# Altium schematic sheet Sheet1.SchDoc
size A2
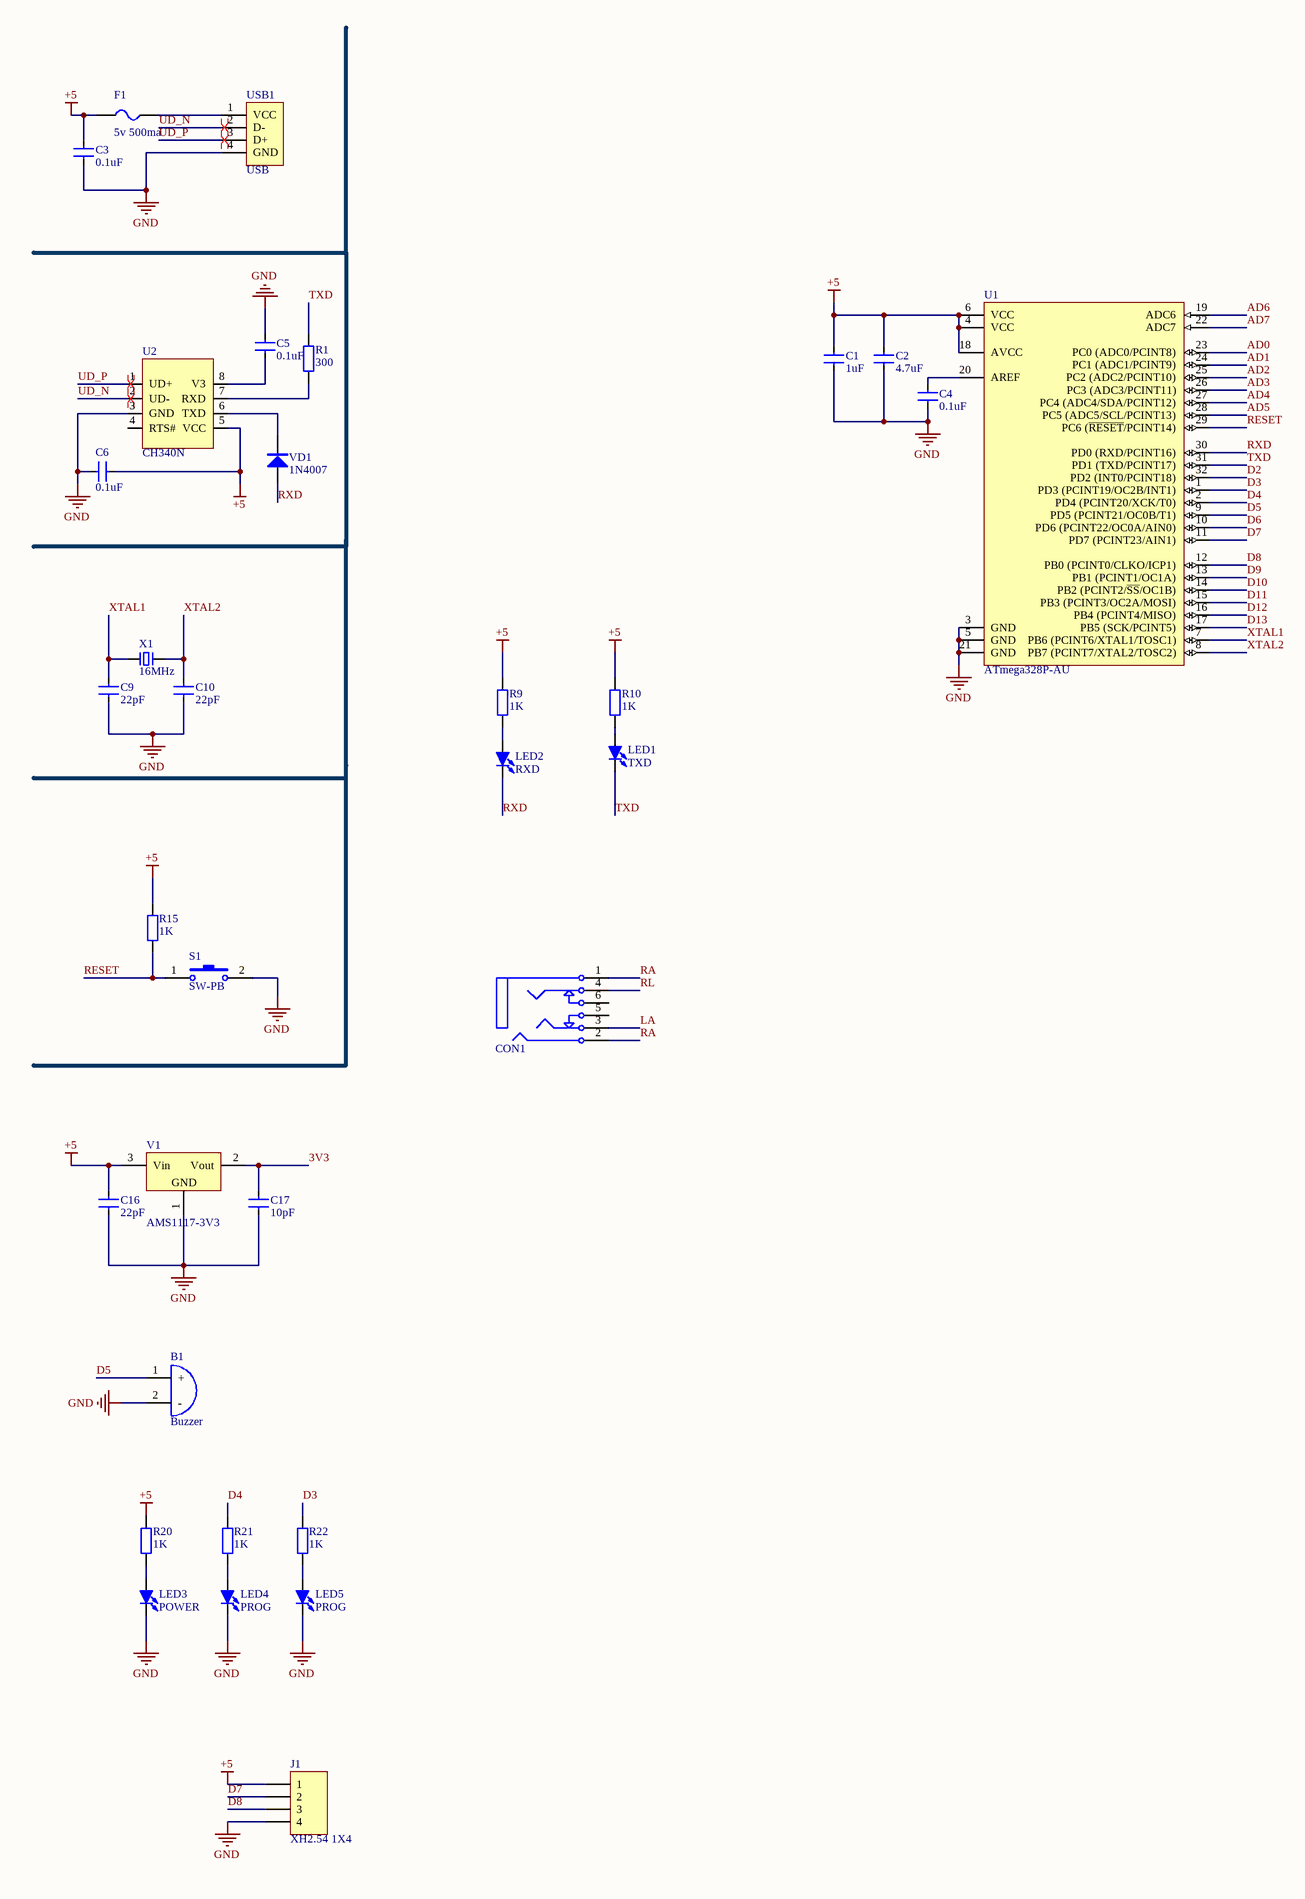
[diagram p0: Sheet1.SchDoc, left]
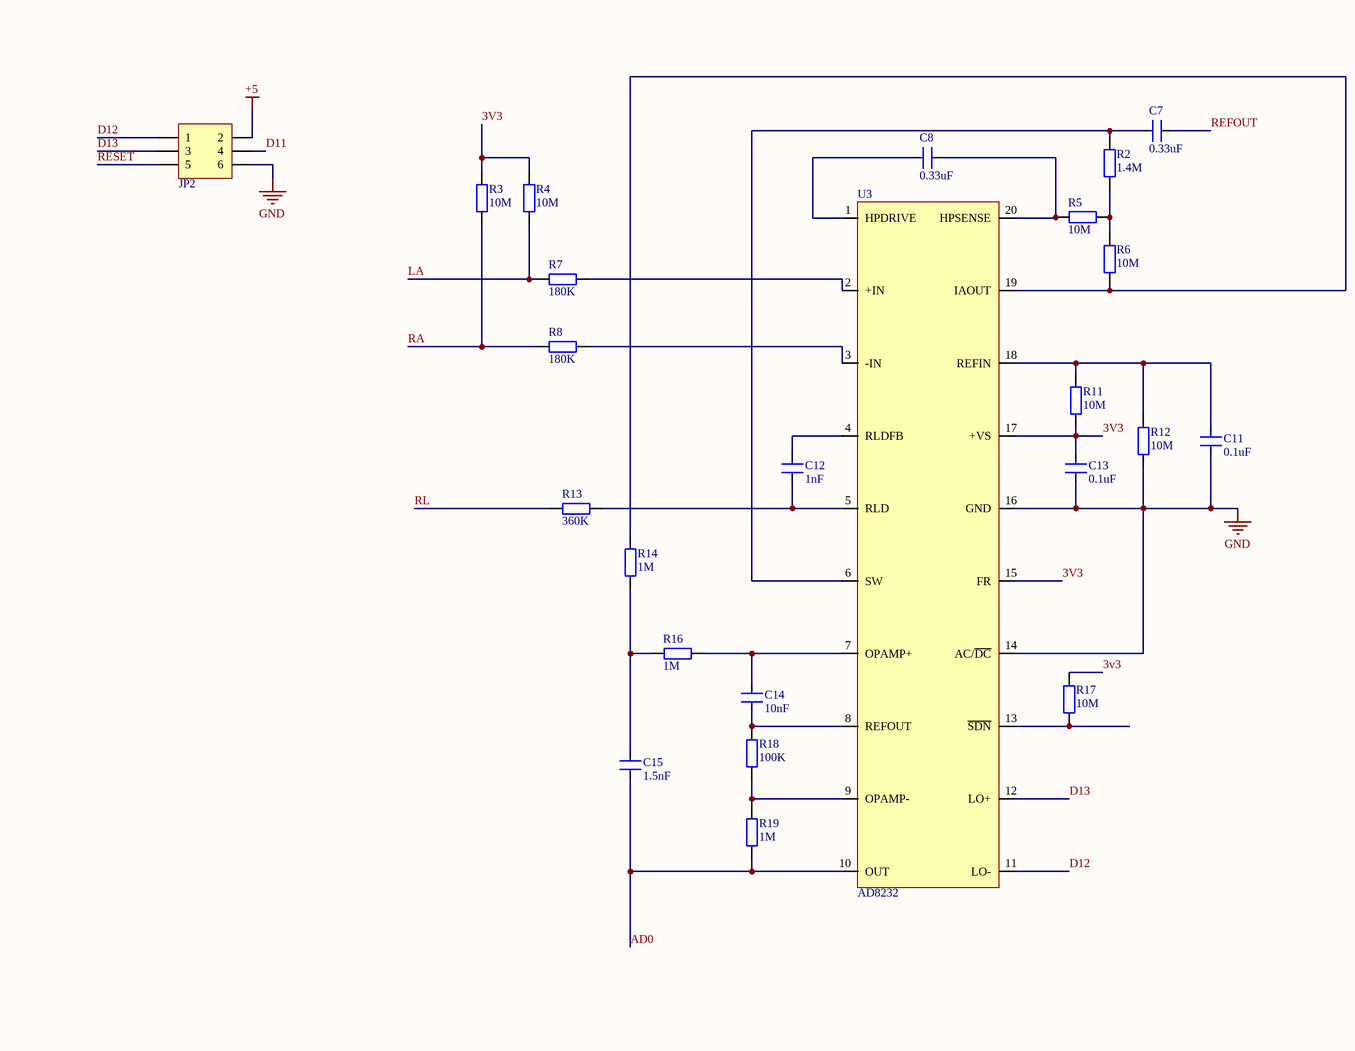
[diagram p1: Sheet1.SchDoc, right]

## Parts
B1  Buzzer  [Buzzer]
C1  1uF  [C0805]
C2  4.7uF  [C0805]
C3  0.1uF  [C0805]
C4  0.1uF  [C0805]
C5  0.1uF  [C0805]
C6  0.1uF  [C0805]
C7  0.33uF  [C0805]
C8  0.33uF  [C0805]
C9  22pF  [C0805]
C10  22pF  [C0805]
C11  0.1uF  [C0805]
C12  1nF  [C0805]
C13  0.1uF  [C0805]
C14  10nF  [C0805]
C15  1.5nF  [C0805]
C16  22pF  [C0805]
C17  10pF  [C0805]
CON1  PJ342  [PJ342A]  (value not drawn)
F1  5v 500ma  [FU 1210]
J1  XH2.54 1X4  [XHSIP-4]
JP2  Header3X2  [HDR-3X2]  (value not drawn)
LED1  TXD  [LED 0805G]
LED2  RXD  [LED 0805G]
LED3  POWER  [LED 0805G]
LED4  PROG  [LED 0805G]
LED5  PROG  [LED 0805G]
R1  300  [R 0805]
R2  1.4M  [R 0805]
R3  10M  [R 0805]
R4  10M  [R 0805]
R5  10M  [R 0805]
R6  10M  [R 0805]
R7  180K  [R 0805]
R8  180K  [R 0805]
R9  1K  [R 0805]
R10  1K  [R 0805]
R11  10M  [R 0805]
R12  10M  [R 0805]
R13  360K  [R 0805]
R14  1M  [R 0805]
R15  1K  [R 0805]
R16  1M  [R 0805]
R17  10M  [R 0805]
R18  100K  [R 0805]
R19  1M  [R 0805]
R20  1K  [R 0805]
R21  1K  [R 0805]
R22  1K  [R 0805]
S1  SW-PB  [SW-SMD1]
U1  ATmega328P-AU  [32A_N]
U2  CH340N  [SOP8-W2.54_M]
U3  AD8232  [QFN-20]
USB1  USB  [USB-B/S_A]
V1  AMS1117-3V3  [SOT223_L]
VD1  1N4007  [SMA]
X1  16MHz  [XTAL-49S DIP]

## Nets
+5: C1.2 C2.2 C3.2 C6.2 C16.2 F1.1 J1.1 JP2.2 R9.2 R10.2 R15.2 R20.2 U1.4(VCC) U1.6(VCC) U1.18(AVCC) U2.5(VCC) V1.3(Vin)
GND: B1.2(-) C1.1 C2.1 C3.1 C4.1 C5.2 C6.1 C9.1 C10.1 C11.2 C13.2 C16.1 C17.1 J1.4 JP2.6 LED3.2(K) LED4.2(K) LED5.2(K) R12.2 S1.2 U1.3(GND) U1.5(GND) U1.21(GND) U2.3(GND) U3.14(AC/~{DC}) U3.16(GND) USB1.4(GND) V1.1(GND)
3V3: C13.1 C17.2 R3.2 R4.2 R11.2 R17.1 U3.15(FR) U3.17(+VS) V1.2(Vout)
AD0: C15.2 R19.2 U1.23(PC0_(ADC0/PCINT8)) U3.10(OUT)
AD1: U1.24(PC1_(ADC1/PCINT9))
AD2: U1.25(PC2_(ADC2/PCINT10))
AD3: U1.26(PC3_(ADC3/PCINT11))
AD4: U1.27(PC4_(ADC4/SDA/PCINT12))
AD5: U1.28(PC5_(ADC5/SCL/PCINT13))
AD6: U1.19(ADC6)
AD7: U1.22(ADC7)
D2: U1.32(PD2_(INT0/PCINT18))
D3: R22.2 U1.1(PD3_(PCINT19/OC2B/INT1))
D4: R21.2 U1.2(PD4_(PCINT20/XCK/T0))
D5: B1.1(+) U1.9(PD5_(PCINT21/OC0B/T1))
D6: U1.10(PD6_(PCINT22/OC0A/AIN0))
D7: J1.2 U1.11(PD7_(PCINT23/AIN1))
D8: J1.3 U1.12(PB0_(PCINT0/CLKO/ICP1))
D9: U1.13(PB1_(PCINT1/OC1A))
D10: U1.14(PB2_(PCINT2/~{SS}/OC1B))
D11: JP2.4 U1.15(PB3_(PCINT3/OC2A/MOSI))
D12: JP2.1 U1.16(PB4_(PCINT4/MISO)) U3.11(LO-)
D13: JP2.3 U1.17(PB5_(SCK/PCINT5)) U3.12(LO+)
LA: CON1.3 R4.1 R7.1
RA: CON1.1 CON1.2 R3.1 R8.1
REFOUT: C7.1
RESET: JP2.5 R15.1 S1.1 U1.29(PC6_(~{RESET}/PCINT14))
RL: CON1.4 R13.1
RXD: LED2.2(K) U1.30(PD0_(RXD/PCINT16)) VD1.1(A)
TXD: LED1.2(K) R1.2 U1.31(PD1_(TXD/PCINT17))
UD_N: U2.2(UD-) USB1.2(D-)
UD_P: U2.1(UD+) USB1.3(D+)
XTAL1: C9.2 U1.7(PB6_(PCINT6/XTAL1/TOSC1)) X1.1
XTAL2: C10.2 U1.8(PB7_(PCINT7/XTAL2/TOSC2)) X1.2
NetC4_2: C4.2 U1.20(AREF)
NetC5_1: C5.1 U2.8(V3)
NetC7_2: C7.2 R2.1 U3.6(SW)
NetC8_1: C8.1 R5.2 U3.20(HPSENSE)
NetC8_2: C8.2 U3.1(HPDRIVE)
NetC11_1: C11.1 R11.1 R12.1 U3.18(REFIN)
NetC12_1: C12.1 U3.4(RLDFB)
NetC12_2: C12.2 R13.2 U3.5(RLD)
NetC14_1: C14.1 R16.2 U3.7(OPAMP+)
NetC14_2: C14.2 R18.1 U3.8(REFOUT)
NetC15_1: C15.1 R14.2 R16.1
NetF1_2: F1.2 USB1.1(VCC)
NetLED1_1: LED1.1(A) R10.1
NetLED2_1: LED2.1(A) R9.1
NetLED3_1: LED3.1(A) R20.1
NetLED4_1: LED4.1(A) R21.1
NetLED5_1: LED5.1(A) R22.1
NetR1_1: R1.1 U2.7(RXD)
NetR2_2: R2.2 R5.1 R6.1
NetR6_2: R6.2 R14.1 U3.19(IAOUT)
NetR7_2: R7.2 U3.2(+IN)
NetR8_2: R8.2 U3.3(-IN)
NetR17_2: R17.2 U3.13(~{SDN})
NetR18_2: R18.2 R19.1 U3.9(OPAMP-)
NetU2_6: U2.6(TXD) VD1.2(K)

Not connected (* = marked no-connect by the designer): CON1 5 6; U2 4(RTS#)

## Layout directives
differential pair: UD_N, UD_P

## Library data of the parts
C1-C17 = CAP
CON1 = PJ342: 3.5耳机插座,4Pin; BOM名称: 耳机插座
F1 = FU: 贴片保险丝; 版权归属: 源创客; BOM名称: 贴片保险丝; 学习资源: www.ooocke.com
JP2 = Header 3X2: 3*2P接插件; 版权归属: 源创客; BOM名称: 3*2P接插件; 学习资源: www.ooocke.com
LED1-LED5 = LED-SMD: 贴片LED; 版权归属: 源创客; BOM名称: 贴片LED; 学习资源: www.ooocke.com
R1-R22 = R: 贴片电阻; 版权归属: 源创客; BOM名称: 贴片电阻; 学习资源: www.ooocke.com
S1 = SW-PB: Switch; Published: 24-Mar-1999; LatestRevisionDate: 17-Jul-2002; LatestRevisionNote: Re-released for DXP Platform.; PackageReference: SPST-2; Publisher: Altium Limited; PackageDescription: Switch; 2 Leads
U1 = ATmega328P-AU: 8-bit AVR Microcontroller, 32KB Flash, 1KB EEPROM, 2KB SRAM, 32-pin TQFP, Industrial Grade (-40癈 to 85癈); Published: 1-Apr-2010; DatasheetVersion: revA, Jan-2010; PackageVersion: revB, Oct-2001; PackageReference: 32A; Publisher: Altium Limited; PackageDescription: 32-Lead, 7x7x1.0 mm Body, 0.8mm Lead Pitch, Thin Profile Plastic Quad Flat Package (TQFP); Supplier 1: Digi-Key; Supplier Part Number 1: ATMEGA328P-AU-ND; Supplier 2: Farnell; Supplier Part Number 2: 1715486; Supplier 3: Mouser; Supplier Part Number 3: 556-ATMEGA328P-AU; Code_JEDEC: MS-026-ABA; ComponentLink1Description: Manufacturer Link; ComponentLink1URL: http://www.atmel.com/products/avr/default.asp?; ComponentLink2Description: ATmega48A/48PA/88A/88PA/168A/168PA/328/328P Datasheet; ComponentLink2URL: http://www.atmel.com/dyn/resources/prod_documents/8271.pdf; ComponentLink3Description: ATmega48A/48PA/88A/88PA/168A/168PA/328/328P Summary; ComponentLink3URL: http://www.atmel.com/dyn/resources/prod_documents/8271S.pdf; ComponentLink4Description: Atmel.com Home; ComponentLink4URL: http://www.atmel.com
USB1 = USB-B/S: USB-B型母接口; BOM名称: USB-B型母接口
V1 = AMS1117: 三端稳压芯片; BOM名称: 稳压芯片; 版权归属: 源创客; 学习资源: www.ooocke.com
VD1 = 1N4007: 整流二极管; 版权归属: 源创客; BOM名称: 整流二极管; 学习资源: www.ooocke.com
X1 = XTAL-2: 2脚晶振; 版权归属: 源创客; BOM名称: 2脚晶振; 学习资源: www.ooocke.com